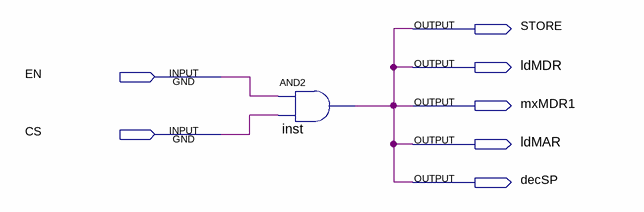
[diagram p0: schematic sheet]
// Quartus schematic PHA.bdf as structural Verilog: 1 symbols, 7 pins
module PHA (
  input  EN,
  input  CS,
  output STORE,
  output ldMDR,
  output mxMDR1,
  output ldMAR,
  output decSP
);

  and inst (decSP, EN, CS);

  assign ldMAR = decSP;
  assign ldMDR = decSP;
  assign mxMDR1 = decSP;
  assign STORE = decSP;
endmodule
